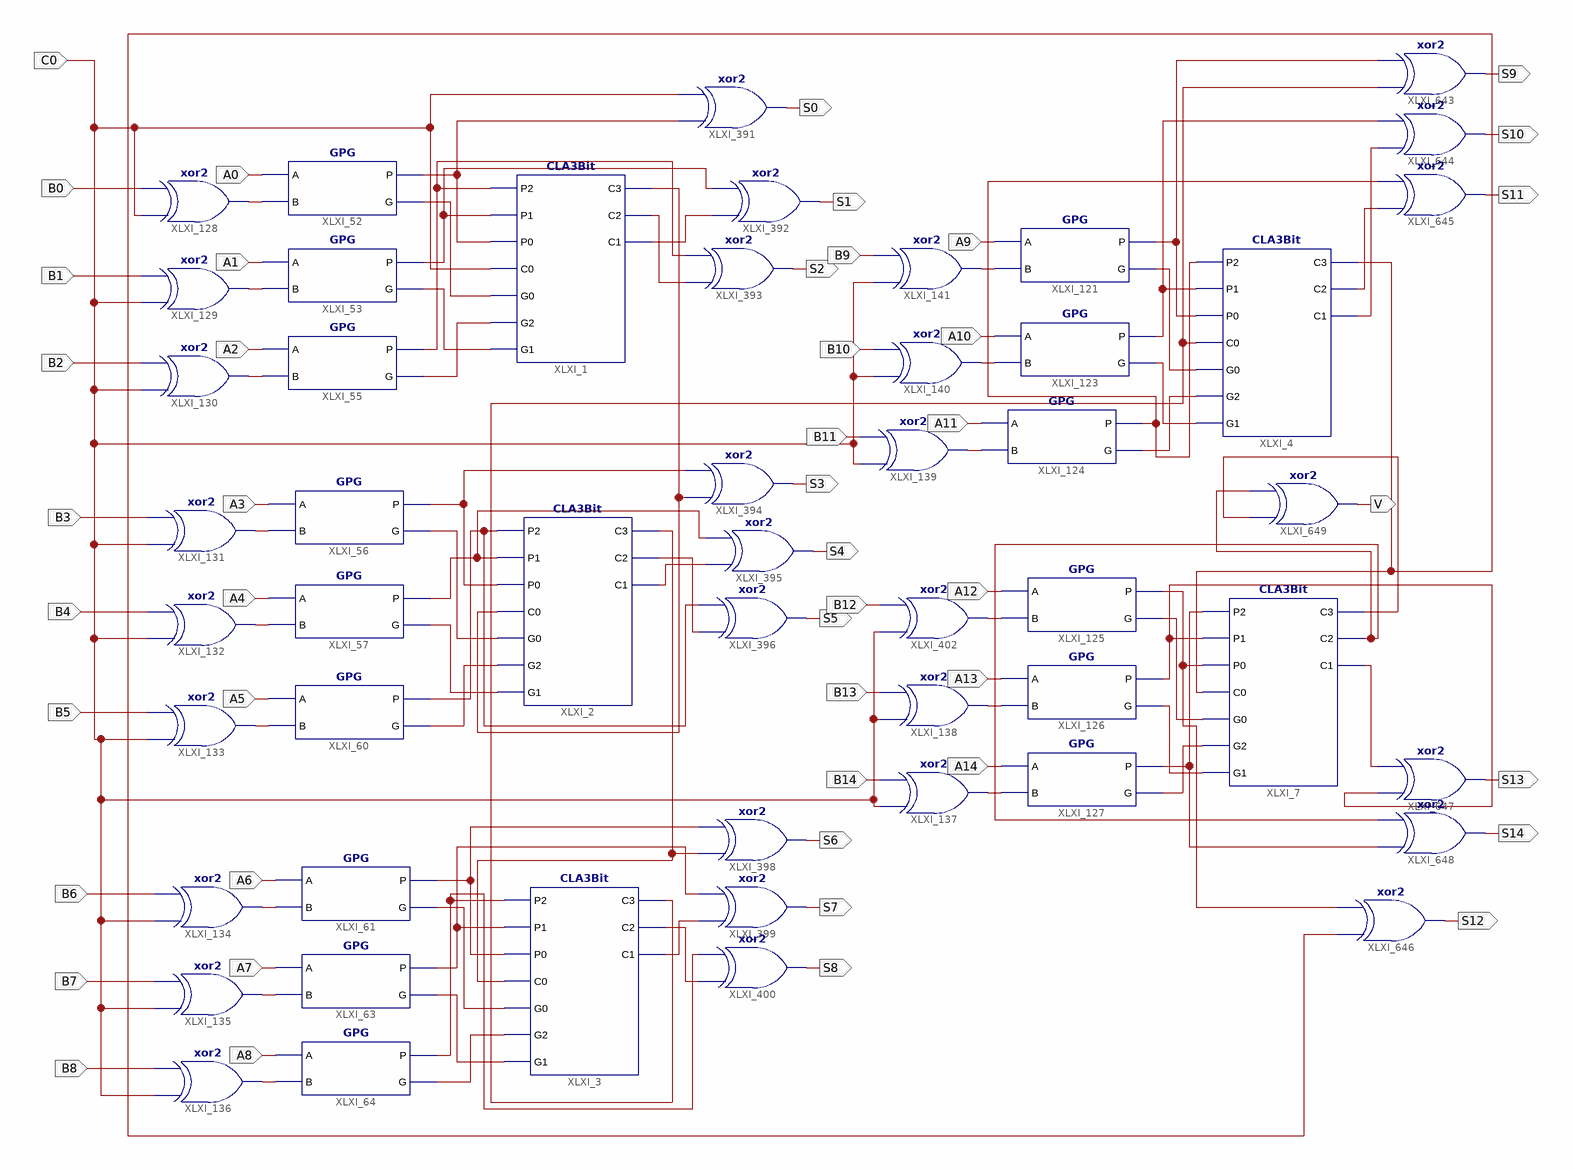
[diagram p0: schematic sheet 1]
// Xilinx ISE schematic CarryLookAHeadHybridlAdderSubtractor15Bit.sch (spartan3e) as structural Verilog: 51 symbols, 47 ports
module CarryLookAHeadHybridlAdderSubtractor15Bit (
  input  B0,
  input  B1,
  input  B2,
  input  B3,
  input  B6,
  input  B7,
  input  B4,
  input  B8,
  input  B5,
  input  A0,
  input  A1,
  input  A2,
  input  A3,
  input  A4,
  input  A5,
  input  A6,
  input  A7,
  input  A8,
  input  C0,
  input  B9,
  input  B10,
  input  B11,
  input  B12,
  input  B13,
  input  B14,
  input  A14,
  input  A13,
  input  A12,
  input  A9,
  input  A10,
  input  A11,
  output S0,
  output S1,
  output S2,
  output S3,
  output S4,
  output S5,
  output S6,
  output S7,
  output S8,
  output S9,
  output S10,
  output S11,
  output V,
  output S13,
  output S14,
  output S12
);

  wire XLXN_2, XLXN_3, XLXN_4, XLXN_5, XLXN_6, XLXN_8, XLXN_9, XLXN_10, XLXN_11, XLXN_12, XLXN_14, XLXN_15,
       XLXN_17, XLXN_18, XLXN_19, XLXN_21, XLXN_23, XLXN_24, XLXN_25, XLXN_26, XLXN_27, XLXN_28, XLXN_29,
       XLXN_30, XLXN_31, XLXN_32, XLXN_33, XLXN_34, XLXN_35, XLXN_36, XLXN_37, XLXN_38, XLXN_39, XLXN_40,
       XLXN_41, XLXN_42, XLXN_43, XLXN_44, XLXN_45, XLXN_445, XLXN_447, XLXN_514, XLXN_515, XLXN_517,
       XLXN_518, XLXN_520, XLXN_524, XLXN_525, XLXN_526, XLXN_527, XLXN_528, XLXN_673, XLXN_1017, XLXN_1024,
       XLXN_1025, XLXN_1026, XLXN_1027, XLXN_1028, XLXN_1029, XLXN_1033;

  GPG XLXI_52 (.A(A0), .B(XLXN_32), .G(XLXN_2), .P(XLXN_447));
  GPG XLXI_53 (.A(A1), .B(XLXN_33), .G(XLXN_4), .P(XLXN_3));
  GPG XLXI_55 (.A(A2), .B(XLXN_34), .G(XLXN_6), .P(XLXN_5));
  GPG XLXI_56 (.A(A3), .B(XLXN_35), .G(XLXN_8), .P(XLXN_525));
  GPG XLXI_57 (.A(A4), .B(XLXN_36), .G(XLXN_10), .P(XLXN_9));
  GPG XLXI_60 (.A(A5), .B(XLXN_37), .G(XLXN_12), .P(XLXN_11));
  GPG XLXI_61 (.A(A6), .B(XLXN_38), .G(XLXN_14), .P(XLXN_526));
  GPG XLXI_63 (.A(A7), .B(XLXN_39), .G(XLXN_17), .P(XLXN_15));
  GPG XLXI_64 (.A(A8), .B(XLXN_40), .G(XLXN_19), .P(XLXN_18));
  CLA3Bit XLXI_1 (
    .C0(C0), .C1(XLXN_514), .C2(XLXN_515), .C3(XLXN_517), .G0(XLXN_2), .G1(XLXN_4), .G2(XLXN_6),
    .P0(XLXN_447), .P1(XLXN_3), .P2(XLXN_5));
  CLA3Bit XLXI_2 (
    .C0(XLXN_517), .C1(XLXN_673), .C2(XLXN_524), .C3(XLXN_518), .G0(XLXN_8), .G1(XLXN_10), .G2(XLXN_12),
    .P0(XLXN_525), .P1(XLXN_9), .P2(XLXN_11));
  CLA3Bit XLXI_3 (
    .C0(XLXN_518), .C1(XLXN_527), .C2(XLXN_528), .C3(XLXN_1033), .G0(XLXN_14), .G1(XLXN_17), .G2(XLXN_19),
    .P0(XLXN_526), .P1(XLXN_15), .P2(XLXN_18));
  xor XLXI_128 (XLXN_32, C0, B0);
  xor XLXI_129 (XLXN_33, C0, B1);
  xor XLXI_130 (XLXN_34, C0, B2);
  xor XLXI_131 (XLXN_35, C0, B3);
  xor XLXI_132 (XLXN_36, C0, B4);
  xor XLXI_133 (XLXN_37, C0, B5);
  xor XLXI_134 (XLXN_38, C0, B6);
  xor XLXI_135 (XLXN_39, C0, B7);
  xor XLXI_136 (XLXN_40, C0, B8);
  xor XLXI_391 (S0, XLXN_447, C0);
  xor XLXI_392 (S1, XLXN_514, XLXN_3);
  xor XLXI_393 (S2, XLXN_515, XLXN_5);
  xor XLXI_394 (S3, XLXN_517, XLXN_525);
  xor XLXI_395 (S4, XLXN_673, XLXN_9);
  xor XLXI_396 (S5, XLXN_524, XLXN_11);
  xor XLXI_398 (S6, XLXN_518, XLXN_526);
  xor XLXI_399 (S7, XLXN_527, XLXN_15);
  xor XLXI_400 (S8, XLXN_528, XLXN_18);
  GPG XLXI_121 (.A(A9), .B(XLXN_45), .G(XLXN_21), .P(XLXN_1028));
  xor XLXI_402 (XLXN_445, C0, B12);
  CLA3Bit XLXI_4 (
    .C0(XLXN_1033), .C1(XLXN_1027), .C2(XLXN_1026), .C3(XLXN_520), .G0(XLXN_21), .G1(XLXN_23), .G2(XLXN_25),
    .P0(XLXN_1028), .P1(XLXN_1029), .P2(XLXN_24));
  xor XLXI_140 (XLXN_44, C0, B10);
  xor XLXI_138 (XLXN_42, C0, B13);
  xor XLXI_137 (XLXN_41, C0, B14);
  GPG XLXI_124 (.A(A11), .B(XLXN_43), .G(XLXN_25), .P(XLXN_24));
  GPG XLXI_127 (.A(A14), .B(XLXN_41), .G(XLXN_31), .P(XLXN_30));
  GPG XLXI_126 (.A(A13), .B(XLXN_42), .G(XLXN_29), .P(XLXN_28));
  GPG XLXI_125 (.A(A12), .B(XLXN_445), .G(XLXN_27), .P(XLXN_26));
  GPG XLXI_123 (.A(A10), .B(XLXN_44), .G(XLXN_23), .P(XLXN_1029));
  CLA3Bit XLXI_7 (
    .C0(XLXN_520), .C1(XLXN_1025), .C2(XLXN_1017), .C3(XLXN_1024), .G0(XLXN_27), .G1(XLXN_29), .G2(XLXN_31),
    .P0(XLXN_26), .P1(XLXN_28), .P2(XLXN_30));
  xor XLXI_141 (XLXN_45, C0, B9);
  xor XLXI_139 (XLXN_43, C0, B11);
  xor XLXI_643 (S9, XLXN_1033, XLXN_1028);
  xor XLXI_644 (S10, XLXN_1027, XLXN_1029);
  xor XLXI_645 (S11, XLXN_1026, XLXN_24);
  xor XLXI_646 (S12, XLXN_520, XLXN_26);
  xor XLXI_647 (S13, XLXN_28, XLXN_1025);
  xor XLXI_648 (S14, XLXN_30, XLXN_1017);
  xor XLXI_649 (V, XLXN_1024, XLXN_1017);
endmodule
